# EAGLE design GBC USB-C Charging Kit (EAGLE 6.2)
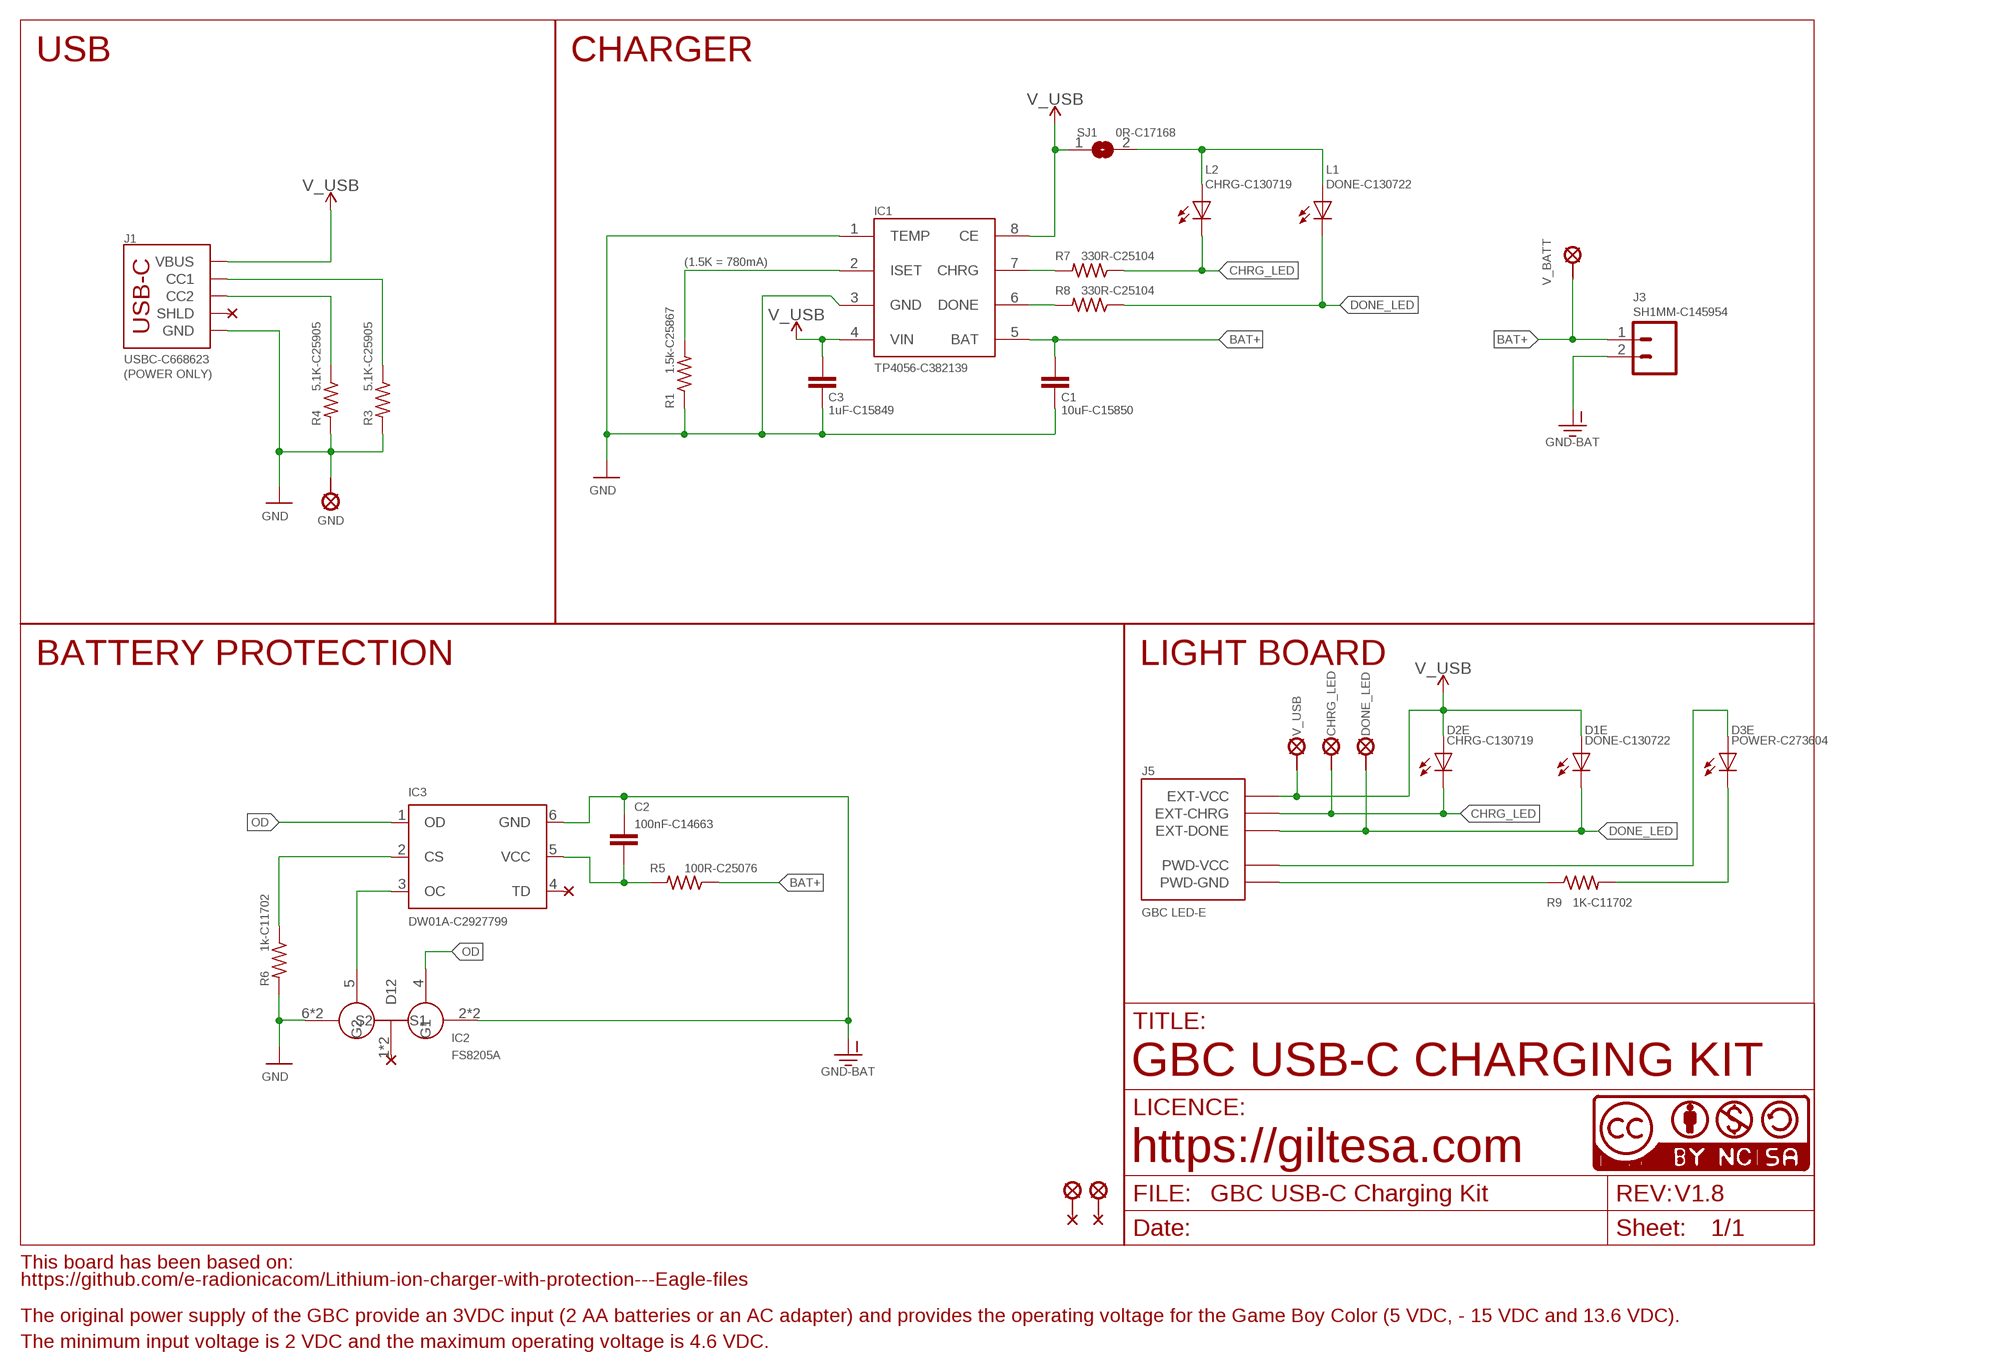
[diagram p0: schematic, sheet 1]

## Parts
C1  10uF-C15850  C0805_SMALL  [C0805_S]
C2  100nF-C14663  C0603_SMALL  [C0603_S]
C3  1uF-C15849  C0603_SMALL  [C0603_S]
D1E  DONE-C130722  L0402  [L0402]
D2E  CHRG-C130719  L0402  [L0402]
D3E  POWER-C273604  L0402  [L0402]
IC1  TP4056-C382139  DIO5158  [SOIC-8]
IC2  8205A-C2929075  FS8205A  [TSSOP8]
IC3  DW01A-C2927799  DW01-P  [SOT23-6L]
J1  USBC-C668623  USB-CPOWER  [USB-C_6P]
J3  SH1MM-C145954  JST-21MM  [JST-2-1MM-SMD_RIGHT]
J5  GBC LED-E  GBC_LED  [GBC_LED]
L1  DONE-C130722  L0402  [L0402]
L2  CHRG-C130719  L0402  [L0402]
R1  1.5k-C25867  R0402  [R0402]
R3  5.1K-C25905  R0402  [R0402]
R4  5.1K-C25905  R0402  [R0402]
R5  100R-C25076  R0402  [R0402]
R6  1k-C11702  R0402  [R0402]
R7  330R-C25104  R0402  [R0402]
R8  330R-C25104  R0402  [R0402]
R9  1K-C11702  R0402  [R0402]
SJ1  0R-C17168  JUMPER-SMD0402  [JUMPER-SMD_0402]
U$2  GND  PAD_1.25  [PAD_1.25]
U$17  CC-NC-BCNIX  [CC-NC-B_NIX]
U$18  SOLDER_PAD-2.5  [SOLDER_PAD_2.5]
U$24  CHRG_LED  SOLDER_PAD-1.3  [SOLDER_PAD_1.3]
U$25  DONE_LED  SOLDER_PAD-1.3  [SOLDER_PAD_1.3]
U$26  V_USB  SOLDER_PAD-1.3  [SOLDER_PAD_1.3]
U$29  V_BATT  PAD_1.25  [PAD_1.25]
U$32  SOLDER_PAD-2.5  [SOLDER_PAD_2.5]

## Nets
BAT+: C1.1 IC1.5(BAT) J3.1 R5.1 U$29.P$1
CHRG: IC1.7(CHRG) R7.2
CHRG_LED: D2E.C J5.EXT-CHRG L2.C R7.1 U$24.P$1
DONE: IC1.6(DONE) R8.2
DONE_LED: D1E.C J5.EXT-DONE L1.C R8.1 U$25.P$1
GND: C1.2 C3.2 IC1.1(TEMP) IC1.3(GND) IC2.6(S2) IC2.7(S2) J1.GND1(GND) J1.GND2(GND) R1.1 R3.2 R4.2 R6.2 U$2.P$1
GND-BAT: C2.1 IC2.2(S1) IC2.3(S1) IC3.6(GND) J3.2
ISET: IC1.2(ISET) R1.2
N$1: IC3.2(CS) R6.1
N$2: IC2.5(G2) IC3.3(OC)
N$3: L1.A L2.A SJ1.2
N$4: J1.B5(CC2) R4.1
N$10: D3E.A J5.PWD-VCC
N$11: D3E.C R9.2
N$12: J5.PWD-GND R9.1
N$13: J1.A5(CC1) R3.1
OD: IC2.4(G1) IC3.1(OD)
V_USB: C3.1 D1E.A D2E.A IC1.4(VIN) IC1.8(CE) J1.VBUS1(VBUS) J1.VBUS2(VBUS) J5.EXT-VCC SJ1.1 U$26.P$1
VCC-DW: C2.2 IC3.5(VCC) R5.2
Unconnected: IC2.1(D12) IC2.8(D12) IC3.4(TD) J1.SHLD1(SHLD) J1.SHLD2(SHLD) J1.SHLD3(SHLD) J1.SHLD4(SHLD) J1.SHLD5(SHLD) J1.SHLD6(SHLD) J1.SHLD7(SHLD) J1.SHLD8(SHLD) U$18.P$1 U$32.P$1

## Notes on the sheet
- USB | CHARGER
- (1.5K = 780mA)
- (POWER ONLY)
- BATTERY PROTECTION | LIGHT BOARD
- IC2
- FS8205A
- GBC USB-C CHARGING KIT
- https://giltesa.com
- V1.8
- This board has been based on:
- https://github.com/e-radionicacom/Lithium-ion-charger-with-protection---Eagle-files
- The original power supply of the GBC provide an 3VDC input (2 AA batteries or an AC adapter) and provides the operating voltage for the Game Boy Color (5 VDC, - 15 VDC and 13.6 VDC).
- The minimum input voltage is 2 VDC and the maximum operating voltage is 4.6 VDC.

## Library data of the parts
C1 = ,giltesa:C0805
C2 C3 = ,giltesa:C0603
D1E D2E D3E L1 L2 = ,giltesa:L0402
IC1 = ERADIONICA:DIO5158
IC2 = SparkFun:FS8205A
IC3 = lipo:DW01-P: One Cell Lithium-ion/Polymer Battery Protection IC The DW01-P battery protection IC is designed to protect lithium-ion/polymer battery from damage or degrading the lifetime due to overcharge, overdischarge, and/or overcurrent for one-cell lithium-ion/polymer battery powered systems, such as cellular phones. The ultra-small package and less required external components make it ideal to integrate the DW01-P into the limited space of battery pack. The accurate ±50mV overcharging detection voltage ensures safe and full utilization charging. The very low standby current drains little current from the cell while in storage.
J1 = ,giltesa:USB-C
J3 = ,giltesa:JST-2
J5 = ,giltesa:GBC_LED
R1 R3-R9 = ,giltesa:R0402
SJ1 = ,giltesa:JUMPER-SMD
U$2 U$29 = ,giltesa:PAD
U$17 = cc-by-nc-sa:CC-NC-BC: All hardware is licensed under the Creative Commons Attribution-Noncommercial-Share Alike 2.5 Switzerland License. To view a copy of this license, visit http://creativecommons.org/licenses/by-nc-sa/2.5/ch/ or send a letter to Creative Commons, 171 Second Street, Suite 300, San Francisco, California, 94105, USA.
U$18 U$24-U$26 U$32 = ,giltesa:SOLDER_PAD

## Net classes
1 power: width 0.61 mm, drill 0.406 mm, clearance 0.203 mm
2 gnd: width 0.305 mm, drill 0.406 mm, clearance 0.203 mm
3 power usb: width 0.508 mm, drill 0.406 mm, clearance 0.203 mm

## Board
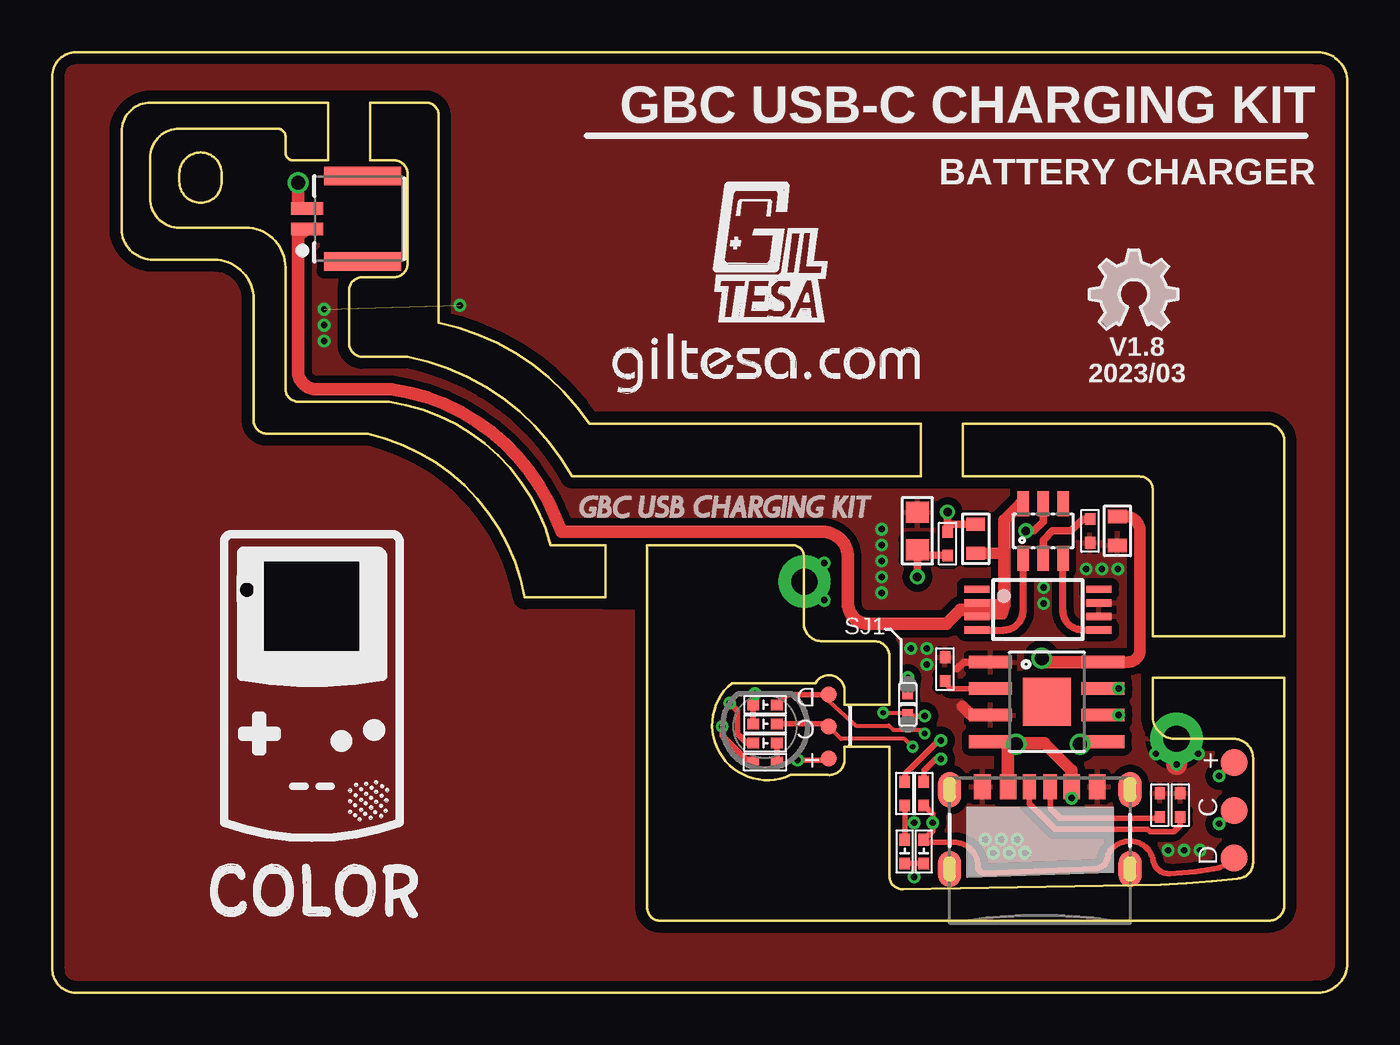
[diagram p1: board, top side]
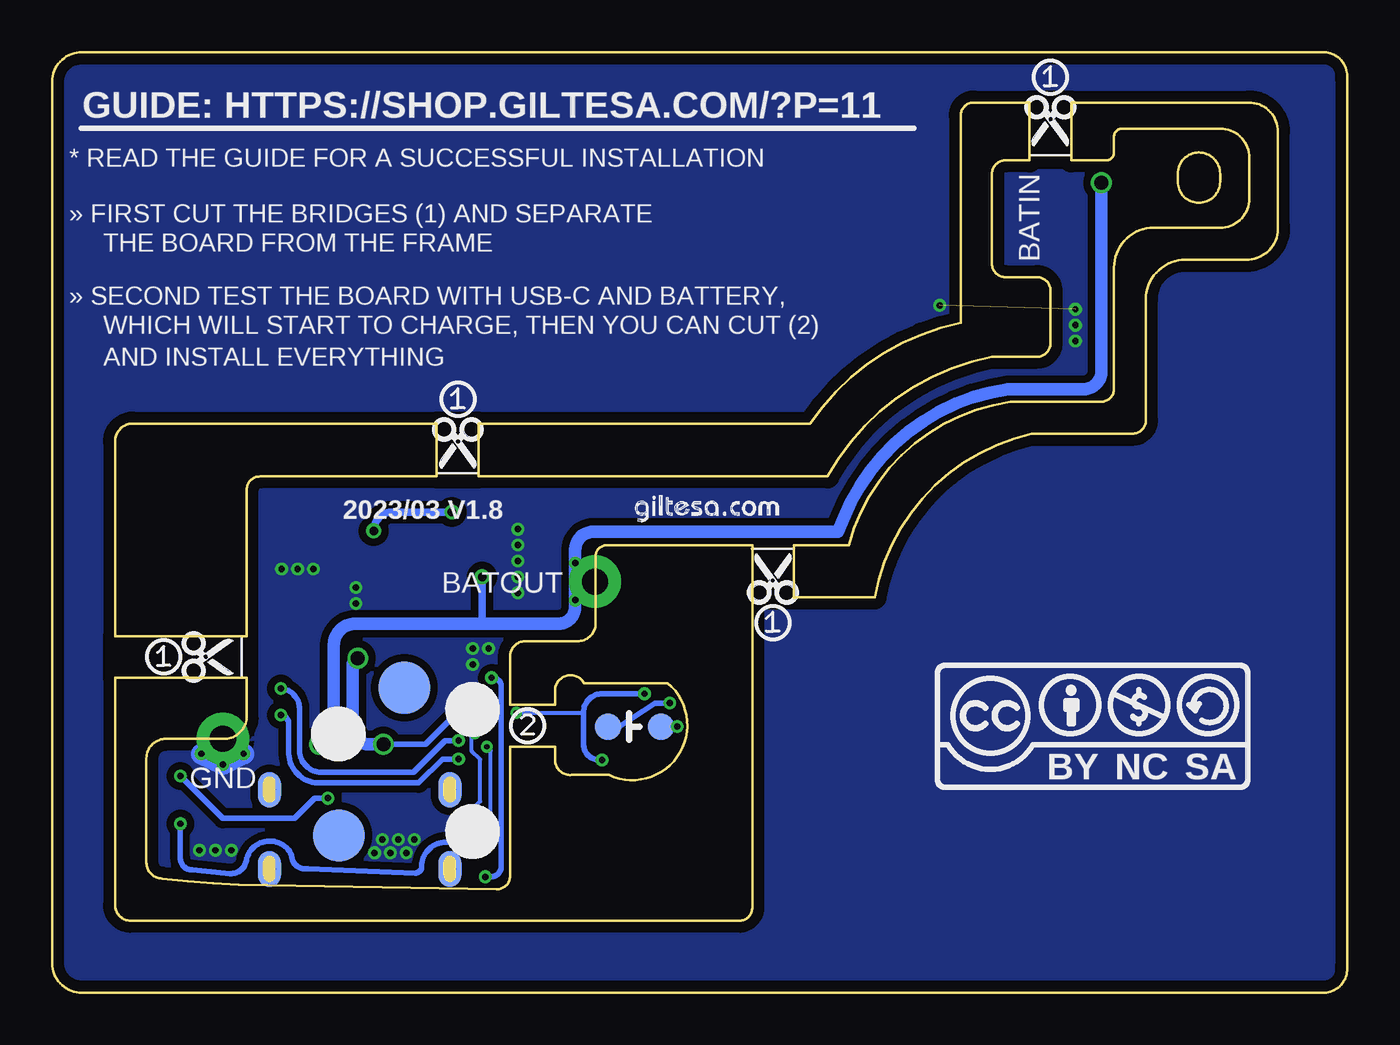
[diagram p2: board, bottom side, seen from below]

Size 62.01 x 45.02 mm. Coordinates in mm from the lower left corner, seen from the top.
Outline: 57.5,11.14 57.5,6.21 arc-90 56.75,5.47 arc-5 53.07,5.17 40.72,4.95 arc-90 40.09,5.58 40.09,11.78 37.94,11.78 37.94,11.1 arc-90 37.14,10.42 35.34,10.42 arc-165 32.54,14.82 36.54,14.82 arc-149 37.94,14.45 37.94,13.78 40.09,13.78 40.09,16.13 arc90 39.32,16.83 36.79,16.83 arc-90 35.99,17.76 35.99,20.92 arc90 35.43,21.42 28.49,21.42 28.49,4.09 arc90 29.09,3.45 58.25,3.45 arc90 59,4.2 59,15.07 52.7,15.07 52.7,13.17 arc90 53.84,12.15 56.63,12.15 arc-90 57.5,11.14
Outline: 1.01,0.01 60.44,0.01 arc90 62.01,1.28 62.01,43.74 arc90 60.44,45.01 1.01,45.01 arc90 0.01,43.74 0.01,1.28 arc90 1.01,0.01
Outline: 24.88,24.71 41.6,24.71 41.6,27.24 25.72,27.24 arc44 18.51,32.07 18.51,41.98 arc90 17.88,42.61 15.22,42.61 15.22,39.84 16.38,39.84 arc-90 17.01,39.2 17.01,34.89 arc-90 16.38,34.25 14.85,34.25 arc90 14.22,33.62 14.22,31.08 arc90 14.85,30.44 17.01,30.44 arc-50 24.88,24.71
Outline: 43.6,24.71 52.06,24.71 arc-90 52.7,24.09 52.7,17.07 59,17.07 59,26.38 arc90 58.16,27.24 43.6,27.24 43.6,24.71
Outline: 16.12,28.28 11.8,28.28 arc-90 11.17,28.92 11.17,34.71 arc90 9.26,36.61 6.09,36.61 arc-90 4.69,38.01 4.69,39.97 arc-90 6.09,41.36 10.79,41.36 arc-90 11.17,40.98 11.17,40.22 arc90 11.55,39.84 13.21,39.84 13.21,42.61 4.72,42.61 arc90 3.32,41.21 3.32,36.69 arc90 4.72,35.09 7.74,35.09 arc-90 9.64,33.18 9.64,27.39 arc90 10.28,26.76 15.12,26.76 arc-67 22.62,18.92 26.49,18.92 26.49,21.42 23.87,21.42 arc67 16.12,28.28
Outline: 6.09,39.2 arc-180 8.12,39.2 8.12,38.82 arc-180 6.09,38.82 6.09,39.2
Copper layers (1*16): Top 0.035mm / dielectric 1.6mm / Bottom 0.035mm
Design rules: minimum track width 6mil, minimum drill 12mil, track to track 6mil, track to pad 6mil, pad to pad 6mil, via to via 8mil, smd to smd 0mil, copper to edge 20mil, drill to drill 10mil, minimum pad ring 6mil, minimum via ring 6mil, stop-mask expansion 0mil, vias tented up to drill 100mil, thermal gap 10mil
tRestrict: area 10.4,16.6 to 14.5,20.4; area 9.4,19.3 to 9.4,19.3; 10 lines
bRestrict: 10 lines

### Footprints (pad centres in the part's own frame; a part is rotated, then mirrored left to right if it is on the bottom)
C0805_S = smd 1 x 1.1: 1 -0.901,0; 2 0.901,0
C0603_S = smd 0.635 x 0.9: 1 -0.694,0; 2 0.694,0
L0402 = smd 0.559 x 0.5: A -0.567,0; C 0.567,0
SOIC-8 = smd 0.61 x 2.057: 1 -2.07,-2.892; 2 -0.8,-2.892; 3 0.47,-2.892; 4 1.74,-2.892; 5 1.74,2.492; 6 0.47,2.492; 7 -0.8,2.492; 8 -2.07,2.492 | smd 2.286 x 2.286: EPAD -0.165,-0.2
TSSOP8 = smd 1.2 x 0.35: 1 -2.925,0.975; 2 -2.925,0.325; 3 -2.925,-0.325; 4 -2.925,-0.975; 5 2.925,-0.975; 6 2.925,-0.325; 7 2.925,0.325; 8 2.925,0.975
SOT23-6L = smd 0.55 x 1.2: 1 -0.95,-1.3; 2 0,-1.3; 3 0.95,-1.3; 4 0.95,1.3; 5 0,1.3; 6 -0.95,1.3
USB-C_6P = smd 0.635 x 1.2: A5 -0.5,-0.017; B5 0.5,-0.017 | smd 0.8 x 1.2: GND1 -2.75,-0.017; GND2 2.75,-0.017; VBUS1 -1.52,-0.017; VBUS2 1.52,-0.017 | smd 1.1 x 1.7: SHLD1 -4.32,-0.15; SHLD2 4.32,-0.15; SHLD5 -4.32,-3.95; SHLD8 4.32,-3.95 | smd 1.1 x 1.7 bottom: SHLD3 -4.32,-0.15; SHLD4 4.32,-0.15; SHLD6 -4.32,-3.95; SHLD7 4.32,-3.95
JST-2-1MM-SMD_RIGHT = smd 0.6 x 1.524: 1 -0.5,-2.017; 2 0.5,-2.017 | smd 0.889 x 3.683: NC1 -2.054,0.635; NC2 2.054,0.635
GBC_LED = smd 0.762 x 0.762: EXT-CHRG -3.048,0; EXT-DONE -3.048,-1.524; EXT-VCC -3.048,1.524 | smd 1.27 x 1.27 bottom: PWD-GND 1.27,0; PWD-VCC -1.27,0
R0402 = smd 0.559 x 0.5: 1 -0.567,0; 2 0.567,0
JUMPER-SMD_0402 = smd 0.635 x 0.5: 1 -0.559,0; 2 0.559,0
PAD_1.25 = drill 1.25 pad 2.5: P$1 0,0
SOLDER_PAD_2.5 = smd 2.5 x 2.5: P$1 0,0
SOLDER_PAD_1.3 = smd 1.3 x 1.3: P$1 0,0

### Placement (x,y rotation side)
C1  41.42,22.11 90 top
C2  44.22,21.72 90 top
C3  51,22.11 270 top
D1E  34.13,13.78 0 top
D2E  34.13,12.87 0 top
D3E  34.13,11.95 0 top
IC1  47.82,13.76 270 top
IC2  47.19,18.33 0 top
IC3  47.45,22.11 0 top
J1  47.28,9.87 0 top
J3  14.22,37.04 270 top
J5  34.13,12.74 180 top
L1  41.73,6.76 90 top
L2  40.82,6.76 90 top
LOGO3  OSHW_LOGO_FILLX0150-NT  [OSHW_FILLX150_NOTEXT]  49.66,31.76 0 top
R1  42.75,15.49 270 top
R3  54.01,8.98 90 top
R4  53.03,8.98 90 top
R5  42.87,21.5 90 top
R6  49.69,22.11 270 top
R7  40.82,9.53 90 top
R8  41.73,9.53 90 top
R9  34.13,11.04 0 top
SJ1  40.97,13.8 90 top
U$2  53.83,12.16 0 top
U$4  [SCISSOR_ONE]  14.21,43.82 0 bottom
U$6  [SCISSOR]  14.21,40.47 90 bottom
U$7  CC-BY-NC-SA15MM  [CC-BY-NC-SA_15MM]  19.75,9.7 0 bottom
U$8  [SCISSOR_ONE]  42.58,28.4 0 bottom
U$9  [GAME_BOY_COLOR_USB_CHARGING_KIT_NON]  25.15,22.74 0 top
U$10  [SCISSOR]  27.5,21.07 270 bottom
U$11  [SCISSOR_ONE]  27.5,17.71 0 bottom
U$12  [GILTESA_LOGO_MASK_7MM]  31.01,32.01 0 top
U$13  [SCISSOR_ONE]  56.66,16.07 0 bottom
U$14  [SCISSOR_TWO]  39.25,12.78 0 bottom
U$15  [SCISSOR]  53.32,16.07 180 bottom
U$17  0.01,0.01 0 top
U$18  45.15,14.6 0 bottom
U$20  GILTESA.COM_MASK  [GILTESA.COM_MASK]  26.71,28.6 0 top
U$21  [GAME_BOY_COLOR_1.2]  7.53,3.56 0 top
U$23  [GAME_BOY_COLOR_2]  8.02,7.22 0 top
U$24  56.59,8.73 0 top
U$25  56.59,6.44 0 top
U$26  56.59,11.01 0 top
U$27  [SCISSOR]  42.58,25.05 90 bottom
U$28  [GILTESA.COM_MASK_7MM]  34.14,22.46 0 bottom
U$29  36.02,19.68 0 top
U$32  48.28,7.53 0 bottom

### Tracks (layer width: path | path; a pad name or v marks a point on that pad's centre or on a via)
BAT+  (via drill 0.3, 0.41, 0.66)
  Top 0.356: v41.42,19.91 C1.1 41.7,20.93 R5.1
  Top 0.61: J3.1 11.74,37.54 11.78,37.61 v11.78,38.77 | IC1.5 49.34,12.02 v49.21,11.89
  Bottom 0.356: v41.42,19.91 41.42,17.54 41.43,17.66
  Bottom 0.61: v11.78,38.77 11.78,29.68 arc90 12.69,28.89 16.25,28.89 arc-60 24.12,22.69 24.38,22.06 36.12,22.06 arc-90 36.96,21.22 v36.96,20.57 36.96,19.82 | 36.96,19.82 v36.96,18.79 | 36.96,19.57 v36.96,18.79 | v36.96,18.79 36.96,18.42 arc90 37.85,17.66 41.43,17.66 47.51,17.66 arc-90 48.52,16.64 48.52,12.58 arc90 v49.21,11.89 | U$29.P$1 36.82,19.68 36.96,19.82
CHRG  (via drill 0.3)
  Top 0.254: R7.2 40.82,10.46 42.43,12.07 v42.55,12.07 | IC1.7 v51.06,14.56
  Bottom 0.254: v42.55,12.07 43.19,12.07 44.71,10.55 49.03,10.55 arc90 50.17,11.56 50.17,13.54 arc-90 v51.06,14.56
CHRG_LED  (via drill 0.25, 0.3)
  Top 0.203: J5.EXT-CHRG 37.77,12.16 40.81,12.16 v41.19,11.77
  Top 0.254: L2.C 40.82,8.14 | R7.1 40.82,8.14 | 40.82,8.14 v41.27,8.14 | v55.87,8.09 56.13,8.26 U$24.P$1 | D2E.C 37.05,12.87 J5.EXT-CHRG
  Bottom 0.203: v41.19,11.77 41.01,11.59 41.01,8.39 v41.27,8.14
  Bottom 0.254: 41.22,8.14 v41.27,8.14 41.27,7.83 arc90 41.9,7.2 43.17,7.2 arc-90 44.32,6.06 arc90 44.62,5.73 49.78,5.93 49.9,5.93 arc90 50.54,6.56 arc-140 52.7,6.44 arc90 53.48,5.7 55.31,5.88 arc90 55.87,6.44 v55.87,8.09
DONE  (via drill 0.3)
  Top 0.254: R8.2 41.73,10.62 42.3,11.18 v42.55,11.18 | IC1.6 v51.06,13.29
  Bottom 0.254: v42.55,11.18 43.31,11.18 44.46,10.04 49.16,10.04 arc90 50.68,11.44 50.68,12.78 arc-90 v51.06,13.29
DONE_LED  (via drill 0.25, 0.3)
  Top 0.203: J5.EXT-DONE 37.18,13.96 38.47,12.78 40.06,12.78 40.27,12.58 41.6,12.58 v41.78,12.41
  Top 0.254: R8.1 42.16,8.54 v42.16,8.14 42.16,7.75 L1.C 41.78,7.28 41.78,7.2 43.17,7.2 arc-90 44.32,6.06 arc90 44.62,5.73 49.9,5.93 arc90 50.54,6.56 arc-140 52.7,6.44 arc90 53.48,5.7 54.73,5.8 arc4 55.62,5.93 arc36 U$25.P$1 | J5.EXT-DONE 35.18,14.26 D1E.C
  Bottom 0.203: v42.16,8.14 42.16,8.52 41.52,9.16 41.52,11.17 41.92,11.56 41.92,12.26 v41.78,12.41
GND  (via drill 0.3)  (1 unrouted)
  Top 0.356: IC1.1 43.64,15.83 43.31,15.5
  Top 0.559: IC1.3 44,13.29 43.57,13.72
  Top 1.016: U$2.P$1 v53.83,10.93
  Bottom 1.016: v52.84,11.44 v53.83,10.93 v54.87,11.44
  other vias: 44.67,7.33 45.43,7.33 46.19,7.33 45.05,6.7 45.81,6.7 46.58,6.7 49.5,20.28 50.26,20.28 51.02,20.28 41.88,15.71 41.88,16.47 41.11,16.47 47.46,19.4 47.46,18.63 53.43,6.82 54.2,6.82 54.96,6.82 13.02,32.71 13.02,31.95 19.52,32.9 39.72,22.19 39.72,21.43 39.72,20.67 39.72,19.9 39.72,19.14 13.02,31.19
  pour Top (isolate 0.356): -0.99,46.01 63.01,46.01 63.01,-0.99 -0.99,-0.99
  pour Bottom (isolate 0.356): -0.99,46.01 63.01,46.01 63.01,-0.99 -0.99,-0.99
GND-BAT
  Top 0.305: IC2.3 45.57,18.01 45.47,18.17 | IC2.2 45.13,18.33
  Top 0.356: IC2.2 45.49,18.66 45.6,18.55
  Top 0.508: IC3.6 46.39,23.41 46.36,23.38
  Top 0.559: C2.1 45.41,21.03 45.6,21.22
  Top 0.61: J3.2 11.78,36.25 11.78,29.68 arc90 12.69,28.89 16.25,28.89 arc-60 24.12,22.69 24.38,22.06 36.88,22.06 arc-90 38.11,20.84 38.11,18.55 arc90 39.12,17.66 42.81,17.66 43.48,18.33 45.13,18.33 | 45.47,18.17 45.6,18.55 45.6,21.22 45.6,22.61 46.36,23.38
ISET
  Top 0.254: IC1.2 42.98,14.56 R1.2
N$1
  Top 0.356: IC3.2 47.45,21.66 47.89,22.11 48.78,22.11 49.34,22.67 R6.1
N$2
  Top 0.33: IC2.5 49.33,17.36 arc-90 48.39,18.3 48.39,20.66 IC3.3
N$3  (via drill 0.3)
  Top 0.254: L1.A L2.A 41.27,6.19 v41.27,5.55 | SJ1.2 40.97,14.99 arc90 v40.97,15.07
  Bottom 0.254: v41.27,5.55 41.01,5.55 arc-90 40.51,6.06 40.51,14.69 arc-90 v40.97,15.07
N$4
  Top 0.254: J1.B5 47.78,8.81 48.25,8.34 52.97,8.34 R4.1
N$10  (via drill 0.3)
  Top 0.254: D3E.A 33.28,11.95 32.82,12.41 32.82,13.49 v32.44,13.87
  Bottom 0.254: v32.44,13.87 33.14,13.87 34.79,12.79 J5.PWD-VCC
N$11
  Top 0.254: R9.2 D3E.C
N$12  (via drill 0.3)
  Top 0.254: R9.1 33.36,11.04 32.08,12.33 v32.08,12.74
  Bottom 0.254: J5.PWD-GND v32.08,12.74
N$13
  Top 0.254: R3.1 54.01,8.01 53.71,7.71 52.57,7.71 52.44,7.83 48,7.83 46.78,9.05 J1.A5
OD
  Top 0.33: IC2.4 45.55,17.36 arc90 46.49,18.3 46.49,20.66 IC3.1
V_USB  (via drill 0.25, 0.3, 0.66)
  Top 0.203: 40.89,13.3 40.94,13.24 SJ1.1 40.81,13.4 v39.78,13.4
  Top 0.254: J1.VBUS2 v48.8,9.31 | v55.87,10.37 56.51,11.01 U$26.P$1 | v33.65,14.31 33.56,14.23 D1E.A D2E.A | v35.68,11.14 37.1,11.14 arc90 J5.EXT-VCC | SJ1.1 v41.78,13.24
  Top 0.33: IC1.4 44.13,12.02
  Top 0.559: IC1.8 51.52,15.83 arc90 52.08,16.39 52.08,22.11 arc90 51.38,22.8 C3.1
  Top 0.61: IC1.8 47.43,15.83 v47.38,16.01 | 45.6,12.02 46.02,12.02 v46.15,11.89 | 45.6,12.02 v46.15,11.89 | J1.VBUS1 45.76,11.85 45.6,12.02 | J1.VBUS2 48.8,10.65 47.51,11.95 46.2,11.95 v46.15,11.89 | IC1.4 45.6,12.02
  Bottom 0.203: v39.78,13.4 36.59,13.4 36.57,13.42
  Bottom 0.254: v48.8,9.31 49.44,9.31 50.41,8.34 53.84,8.34 v55.87,10.37 | v33.65,14.31 35.68,14.31 arc-90 36.57,13.42 36.57,11.9 arc-90 35.81,11.14 v35.68,11.14 | v41.78,13.24 42.78,13.24 44.13,11.89 v46.15,11.89
  Bottom 0.61: v47.38,16.01 47.63,15.76 47.63,12.71 arc-90 46.82,11.89 v46.15,11.89
VCC-DW  (via drill 0.41)
  Top 0.356: IC3.5 47.45,22.55 47,22.11 v46.62,22.11 | R5.2 v42.87,23.01 | 42.89,22.11 R5.2 | C2.2 42.87,22.42 R5.2
  Bottom 0.356: v42.87,23.01 45.71,23.01 arc-90 v46.62,22.11

### Text on the board
tPlace: GBC USB-C CHARGING KIT | BATTERY CHARGER | V1.8 | 2023/03 | SJ1 | D | C | + | + | C | D
bPlace: GUIDE: HTTPS://SHOP.GILTESA.COM/?P=11 | * READ THE GUIDE FOR A SUCCESSFUL INSTALLATION | » FIRST CUT THE BRIDGES (1) AND SEPARATE | THE BOARD FROM THE FRAME | BATIN | » SECOND TEST THE BOARD WITH USB-C AND BATTERY, | WHICH WILL START TO CHARGE, THEN YOU CAN CUT (2) | AND INSTALL EVERYTHING | 2023/03 V1.8 | BATOUT | GND